# Altium schematic sheet SOM EMMC, SDMMC, PCIE, ADC.SchDoc
size A4; SheetNumber: 7; SheetTotal: 7
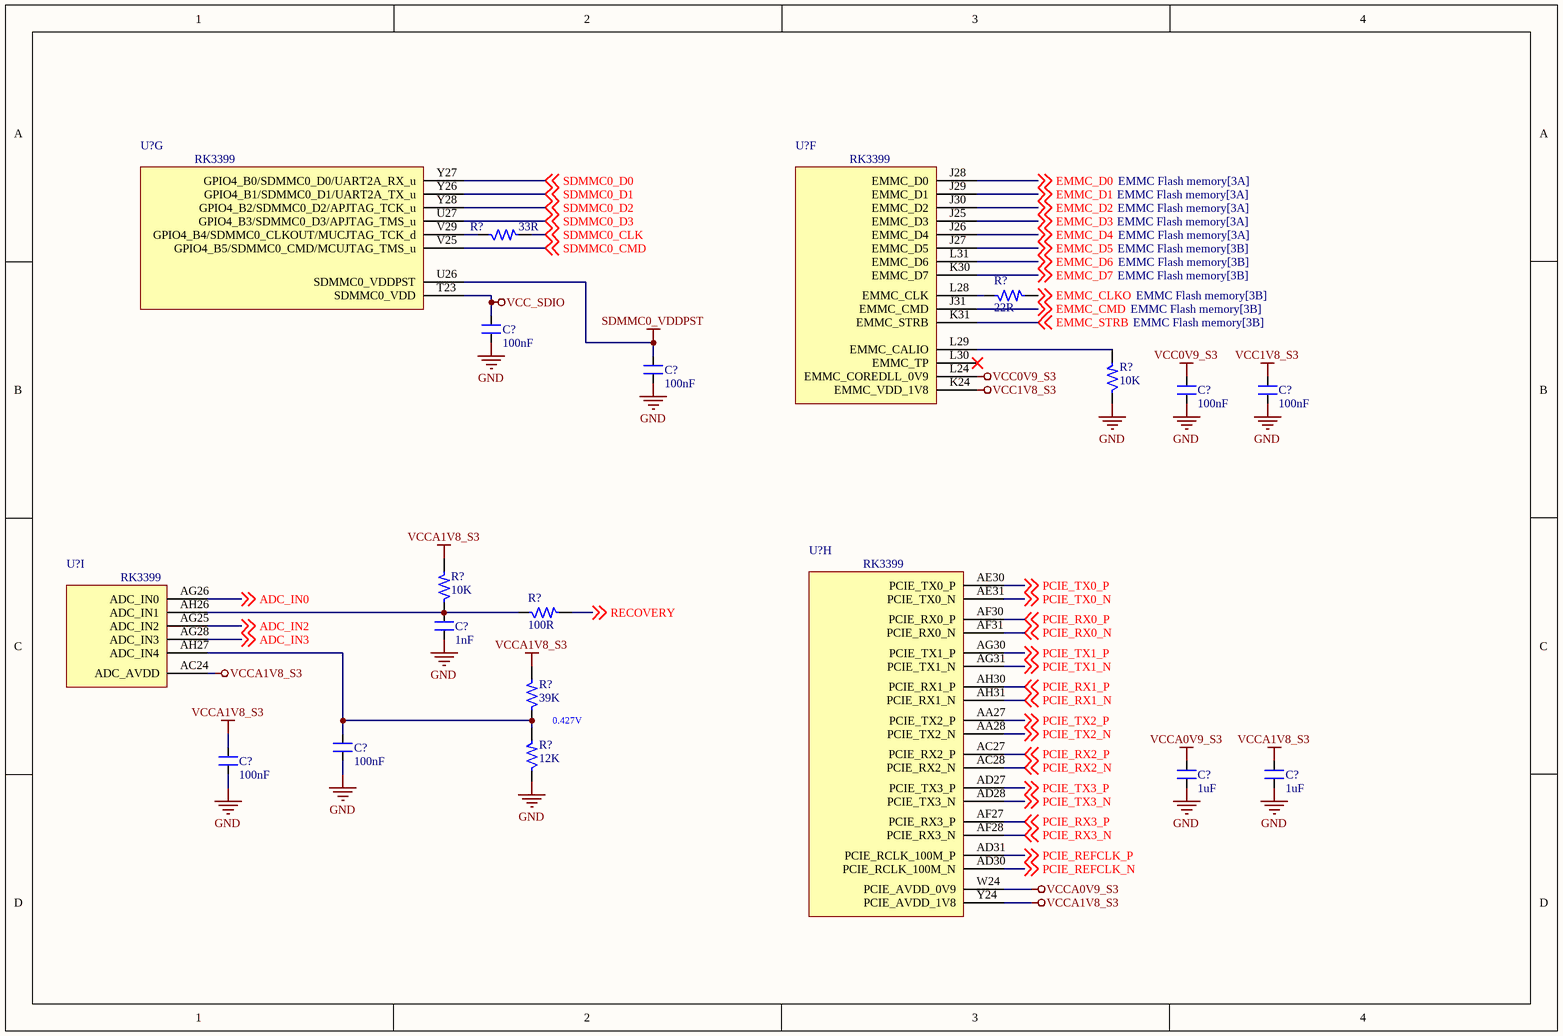
[diagram p0: SOM EMMC, SDMMC, PCIE, ADC.SchDoc]

## Parts
(Parts that share a designator on the sheet are numbered #1, #2 ... from top to bottom, then left to right.)
C?#1  100nF  [CAP_0201]
C?#2  100nF  [CAP_0201]
C?#3  100nF  [CAP_0201]
C?#4  100nF  [CAP_0201]
C?#5  1nF  [CAP_0201]
C?#6  100nF  [CAP_0201]
C?#7  100nF  [CAP_0201]
C?#8  1uF  [CAP_0201]
C?#9  1uF  [CAP_0201]
R?#1  33R  [RES_0201]
R?#2  22R  [RES_0201]
R?#3  10K  [RES_0201]
R?#4  10K  [RES_0201]
R?#5  100R  [RES_0201]
R?#6  39K  [RES_0201]
R?#7  12K  [RES_0201]
U?#1  RK3399  [FBGA828_23_826X826]  (part G of 24)
U?#2  RK3399  [FBGA828_23_826X826]  (part F of 24)
U?#3  RK3399  [FBGA828_23_826X826]  (part H of 24)
U?#4  RK3399  [FBGA828_23_826X826]  (part I of 24)

## Nets
GND: C?#1.1 C?#2.1 C?#3.1 C?#4.1 C?#5.1 C?#6.1 C?#7.1 C?#8.1 C?#9.1 R?#3.1 R?#7.1
SDMMC0_VDDPST: C?#2.2 U?#1.U26(SDMMC0_VDDPST)
VCC0V9_S3: C?#3.2 U?#2.L24(EMMC_COREDLL_0V9)
VCC1V8_S3: C?#4.2 U?#2.K24(EMMC_VDD_1V8)
VCC_SDIO: C?#1.2 U?#1.T23(SDMMC0_VDD)
VCCA0V9_S3: C?#8.2 U?#3.W24(PCIE_AVDD_0V9)
VCCA1V8_S3: C?#7.2 C?#9.2 R?#4.2 R?#6.2 U?#3.Y24(PCIE_AVDD_1V8) U?#4.AC24(ADC_AVDD)
ADC_IN0: U?#4.AG26(ADC_IN0) ; off-sheet ADC_IN0
ADC_IN2: U?#4.AG25(ADC_IN2) ; off-sheet ADC_IN2
ADC_IN3: U?#4.AG28(ADC_IN3) ; off-sheet ADC_IN3
EMMC_CLKO: R?#2.2 ; off-sheet EMMC_CLKO
EMMC_CMD: U?#2.J31(EMMC_CMD) ; off-sheet EMMC_CMD
EMMC_D0: U?#2.J28(EMMC_D0) ; off-sheet EMMC_D0
EMMC_D1: U?#2.J29(EMMC_D1) ; off-sheet EMMC_D1
EMMC_D2: U?#2.J30(EMMC_D2) ; off-sheet EMMC_D2
EMMC_D3: U?#2.J25(EMMC_D3) ; off-sheet EMMC_D3
EMMC_D4: U?#2.J26(EMMC_D4) ; off-sheet EMMC_D4
EMMC_D5: U?#2.J27(EMMC_D5) ; off-sheet EMMC_D5
EMMC_D6: U?#2.L31(EMMC_D6) ; off-sheet EMMC_D6
EMMC_D7: U?#2.K30(EMMC_D7) ; off-sheet EMMC_D7
EMMC_STRB: U?#2.K31(EMMC_STRB) ; off-sheet EMMC_STRB
PCIE_REFCLK_N: U?#3.AD30(PCIE_RCLK_100M_N) ; off-sheet PCIE_REFCLK_N
PCIE_REFCLK_P: U?#3.AD31(PCIE_RCLK_100M_P) ; off-sheet PCIE_REFCLK_P
PCIE_RX0_N: U?#3.AF31(PCIE_RX0_N) ; off-sheet PCIE_RX0_N
PCIE_RX0_P: U?#3.AF30(PCIE_RX0_P) ; off-sheet PCIE_RX0_P
PCIE_RX1_N: U?#3.AH31(PCIE_RX1_N) ; off-sheet PCIE_RX1_N
PCIE_RX1_P: U?#3.AH30(PCIE_RX1_P) ; off-sheet PCIE_RX1_P
PCIE_RX2_N: U?#3.AC28(PCIE_RX2_N) ; off-sheet PCIE_RX2_N
PCIE_RX2_P: U?#3.AC27(PCIE_RX2_P) ; off-sheet PCIE_RX2_P
PCIE_RX3_N: U?#3.AF28(PCIE_RX3_N) ; off-sheet PCIE_RX3_N
PCIE_RX3_P: U?#3.AF27(PCIE_RX3_P) ; off-sheet PCIE_RX3_P
PCIE_TX0_N: U?#3.AE31(PCIE_TX0_N) ; off-sheet PCIE_TX0_N
PCIE_TX0_P: U?#3.AE30(PCIE_TX0_P) ; off-sheet PCIE_TX0_P
PCIE_TX1_N: U?#3.AG31(PCIE_TX1_N) ; off-sheet PCIE_TX1_N
PCIE_TX1_P: U?#3.AG30(PCIE_TX1_P) ; off-sheet PCIE_TX1_P
PCIE_TX2_N: U?#3.AA28(PCIE_TX2_N) ; off-sheet PCIE_TX2_N
PCIE_TX2_P: U?#3.AA27(PCIE_TX2_P) ; off-sheet PCIE_TX2_P
PCIE_TX3_N: U?#3.AD28(PCIE_TX3_N) ; off-sheet PCIE_TX3_N
PCIE_TX3_P: U?#3.AD27(PCIE_TX3_P) ; off-sheet PCIE_TX3_P
RECOVERY: R?#5.2 ; off-sheet RECOVERY
SDMMC0_CLK: R?#1.2 ; off-sheet SDMMC0_CLK
SDMMC0_CMD: U?#1.V25(GPIO4_B5/SDMMC0_CMD/MCUJTAG_TMS_u) ; off-sheet SDMMC0_CMD
SDMMC0_D0: U?#1.Y27(GPIO4_B0/SDMMC0_D0/UART2A_RX_u) ; off-sheet SDMMC0_D0
SDMMC0_D1: U?#1.Y26(GPIO4_B1/SDMMC0_D1/UART2A_TX_u) ; off-sheet SDMMC0_D1
SDMMC0_D2: U?#1.Y28(GPIO4_B2/SDMMC0_D2/APJTAG_TCK_u) ; off-sheet SDMMC0_D2
SDMMC0_D3: U?#1.U27(GPIO4_B3/SDMMC0_D3/APJTAG_TMS_u) ; off-sheet SDMMC0_D3
NetC?#5_2: C?#5.2 R?#4.1 R?#5.1 U?#4.AH26(ADC_IN1)
NetC?#6_2: C?#6.2 R?#6.1 R?#7.2 U?#4.AH27(ADC_IN4)
NetR?#1_1: R?#1.1 U?#1.V29(GPIO4_B4/SDMMC0_CLKOUT/MUCJTAG_TCK_d)
NetR?#2_1: R?#2.1 U?#2.L28(EMMC_CLK)
NetR?#3_2: R?#3.2 U?#2.L29(EMMC_CALIO)

Not connected (* = marked no-connect by the designer): U?#2 L30(EMMC_TP)*

## Notes on the sheet
- (near R?#6) 0.427V

## Library data of the parts
C?#1-C?#4 C?#6 C?#7 = CAP_100nF-25V-10%-0201: 0.1µF ±10% 25V Ceramic Capacitor X5R 0201 (0603 Metric); Manufacturer: TDK Corporation; Manufacturer Part Number: C0603X5R1E104K030BB; Case/Package: 0201; Supplier-1: Digikey
C?#5 = CAP_1nF-16V-10%-0201: 1000pF ±10% 16V Ceramic Capacitor X7R 0201 (0603 Metric); Manufacturer: Murata Electronics; Manufacturer Part Number: GRM033R71C102KA01D; Case/Package: 0201; Supplier-1: Digikey
C?#8 C?#9 = CAP_1uF-16V-10%-0201: 1µF ±20% 16V Ceramic Capacitor X5R 0201 (0603 Metric); Manufacturer: Samsung Electro-Mechanics; Manufacturer Part Number: CL03A105MO3NRNH; Case/Package: 0201; Supplier-1: Digikey
R?#1 = RES_33R-0.05W-1%-0201: 33 Ohms ±1% 0.05W, 1/20W Chip Resistor 0201 (0603 Metric) Thick Film; Manufacturer: Yageo; Manufacturer Part Number: RC0201FR-0733RL; Case/Package: 0201; Supplier-1: Digikey
R?#2 = RES_22R-0.05W-1%-0201: 22 Ohms ±1% 0.05W, 1/20W Chip Resistor 0201 (0603 Metric) Moisture Resistant Thick Film; Manufacturer: Yageo; Manufacturer Part Number: RC0201FR-0722RL; Case/Package: 0201; Supplier-1: Digikey
R?#3 R?#4 = RES_10K-0.05W-1%-0201: 10 kOhms ±1% 0.05W, 1/20W Chip Resistor 0201 (0603 Metric) Thick Film; Manufacturer: Stackpole Electronics Inc; Manufacturer Part Number: RMCF0201FT10K0; Case/Package: 0201; Supplier-1: Digikey
R?#5 = RES_100R-0.05W-1%-0201: 100 kOhms ±1% 0.05W, 1/20W Chip Resistor 0201 (0603 Metric) Automotive AEC-Q200 Thick Film; Manufacturer: Panasonic Electronic Components; Manufacturer Part Number: ERJ-1GNF1003C; Case/Package: 0201; Supplier-1: Digikey
R?#6 = RES_39K-0.05W-1%-0201: 39 kOhms ±1% 0.05W, 1/20W Chip Resistor 0201 (0603 Metric) Thick Film; Manufacturer: Yageo; Manufacturer Part Number: RC0201FR-0739KL; Case/Package: 0201; Supplier-1: Digikey
R?#7 = RES_12K-0.05W-1%-0201: 12 kOhms ±1% 0.05W, 1/20W Chip Resistor 0201 (0603 Metric) Thick Film; Manufacturer: Yageo; Manufacturer Part Number: RC0201FR-0712KL; Case/Package: 0201; Supplier-1: Digikey
U?#1-U?#4 = IC_RK3399-FCBGA828: RK3399 is a low power, high performance processor for computing, personal mobile.; Manufacturer: Rockchip; Manufacturer Part Number: RK3399; Case/Package: FCBGA828; Supplier-1: Rockchip